# Altium schematic sheet MCED_schematic.SchDoc
size A; SheetNumber: 1; SheetTotal: 1
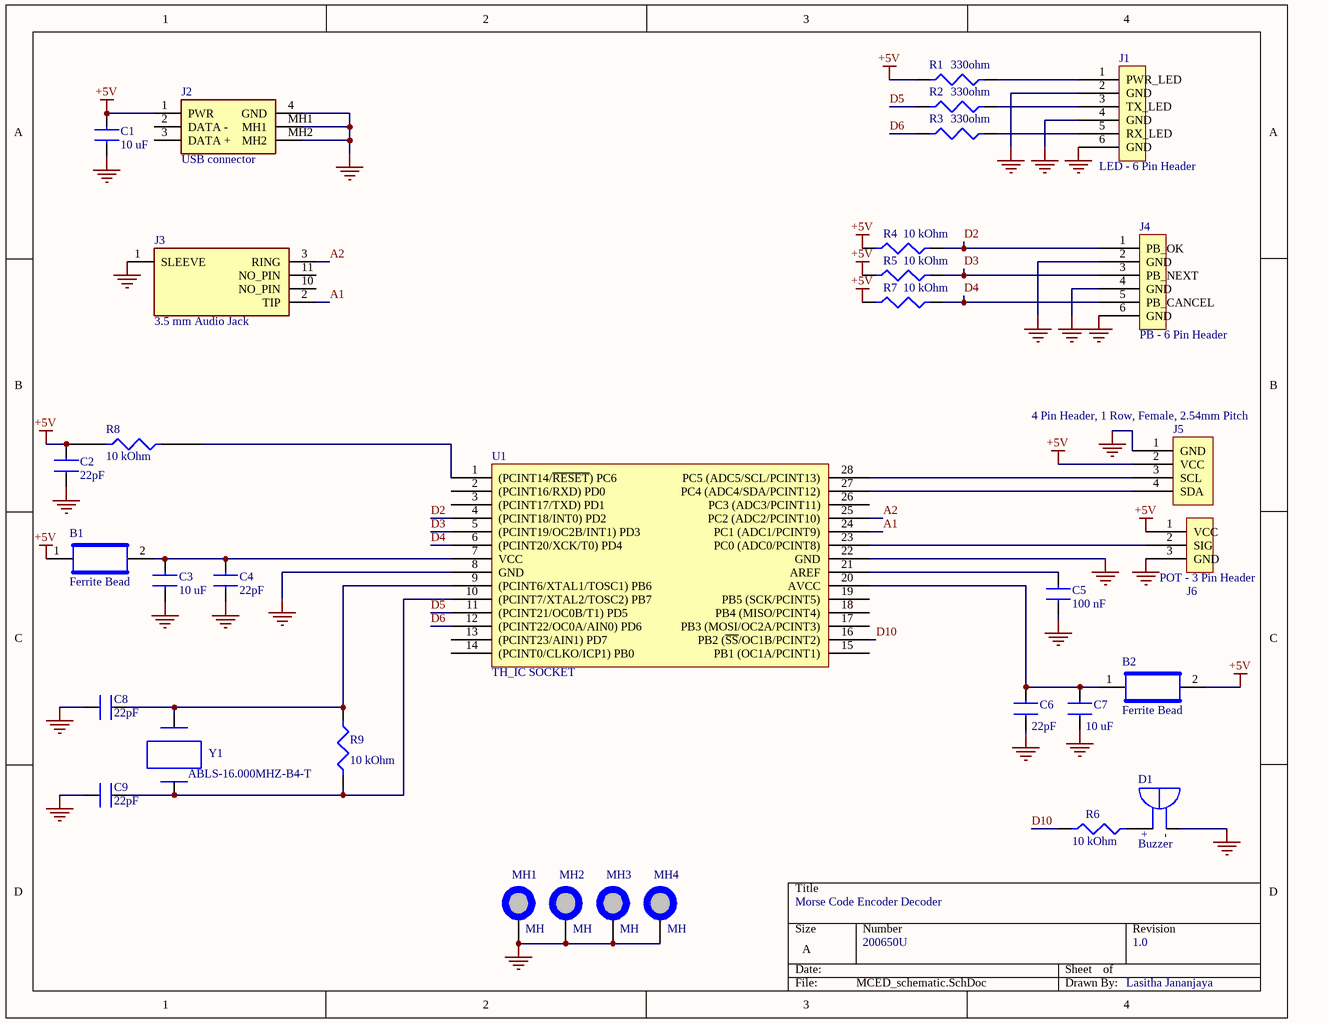
[diagram p0: MCED_schematic.SchDoc]

## Parts
B1  Ferrite Bead  [FERRITE BEAD C2012X105N]
B2  Ferrite Bead  [FERRITE BEAD C2012X105N]
C1  10 uF  [C0805]
C2  22pF  [C0805]
C3  10 uF  [C0805]
C4  22pF  [C0805]
C5  100 nF  [C0805]
C6  22pF  [C0805]
C7  10 uF  [C0805]
C8  22pF  [C0805]
C9  22pF  [C0805]
D1  Buzzer  [Buzzer]
J1  LED - 6 Pin Header  [6 PIN HEADER]
J2  USB connector  [USB 2.0 type B 617291011BLF]
J3  3.5 mm Audio Jack  [Audio Jack SJ13523N]
J4  PB - 6 Pin Header  [6 PIN HEADER]
J5  4 Pin Header, 1 Row, Female, 2.54mm Pitch  [4 Pin Header]
J6  POT - 3 Pin Header  [3 PIN HEADER]
MH1  MH  [Mounting Hole]  (no BOM)
MH2  MH  [Mounting Hole]  (no BOM)
MH3  MH  [Mounting Hole]  (no BOM)
MH4  MH  [Mounting Hole]  (no BOM)
R1  330ohm  [300Ohm RESC2012X60N]
R2  330ohm  [300Ohm RESC2012X60N]
R3  330ohm  [300Ohm RESC2012X60N]
R4  10 kOhm  [10K]
R5  10 kOhm  [10K]
R6  10 kOhm  [10K]
R7  10 kOhm  [10K]
R8  10 kOhm  [10K]
R9  10 kOhm  [10K]
U1  TH_IC SOCKET  [28dip_through_hole_ic_socket]
Y1  ABLS-16.000MHZ-B4-T  [ABLS-16.000MHZ-B4-T_CRYSTAL]

## Nets
+5V: B1.1 B2.2 C1.2 C2.2 J2.1(PWR) J5.2(VCC) J6.1(VCC) R1.1 R4.2 R5.2 R7.2 R8.2
GND: C1.1 C2.1 C3.1 C4.1 C5.1 C6.1 C7.1 C8.2 C9.2 D1.N(NEG) J1.2(GND) J1.4(GND) J1.6(GND) J2.4(GND) J2.MH1 J2.MH2 J3.1(SLEEVE) J4.2(GND) J4.4(GND) J4.6(GND) J5.1(GND) J6.3(GND) MH1.1 MH2.1 MH3.1 MH4.1 U1.8(GND) U1.22(GND)
A1: J3.2(TIP) U1.24(PC1_(ADC1/PCINT9))
A2: J3.3(RING) U1.25(PC2_(ADC2/PCINT10))
D2: J4.1(PB_OK) R4.1 U1.4((PCINT18/INT0)_PD2)
D3: J4.3(PB_NEXT) R5.1 U1.5((PCINT19/OC2B/INT1)_PD3)
D4: J4.5(PB_CANCEL) R7.1 U1.6((PCINT20/XCK/T0)_PD4)
D5: R2.1 U1.11((PCINT21/OC0B/T1)_PD5)
D6: R3.1 U1.12((PCINT22/OC0A/AIN0)_PD6)
D10: R6.2 U1.16(PB2_(~{SS}/OC1B/PCINT2))
NetB1_2: B1.2 C3.2 C4.2 U1.7(VCC)
NetB2_1: B2.1 C6.2 C7.2 U1.20(AVCC)
NetC5_2: C5.2 U1.21(AREF)
NetC8_1: C8.1 R9.2 U1.9((PCINT6/XTAL1/TOSC1)_PB6) Y1.2
NetC9_1: C9.1 R9.1 U1.10((PCINT7/XTAL2/TOSC2)_PB7) Y1.1
NetD1_P: D1.P(POS) R6.1
NetJ1_1: J1.1(PWR_LED) R1.2
NetJ1_3: J1.3(TX_LED) R2.2
NetJ1_5: J1.5(RX_LED) R3.2
NetJ5_3: J5.3(SCL) U1.28(PC5_(ADC5/SCL/PCINT13))
NetJ5_4: J5.4(SDA) U1.27(PC4_(ADC4/SDA/PCINT12))
NetJ6_2: J6.2(SIG) U1.23(PC0_(ADC0/PCINT8))
NetR8_1: R8.1 U1.1((PCINT14/~{RESET})_PC6)

Not connected (* = marked no-connect by the designer): J2 2(DATA_-) 3(DATA_+); J3 10(NO_PIN) 11(NO_PIN); U1 2((PCINT16/RXD)_PD0) 3((PCINT17/TXD)_PD1) 13((PCINT23/AIN1)_PD7) 14((PCINT0/CLKO/ICP1)_PB0) 15(PB1_(OC1A/PCINT1)) 17(PB3_(MOSI/OC2A/PCINT3)) 18(PB4_(MISO/PCINT4)) 19(PB5_(SCK/PCINT5)) 26(PC3_(ADC3/PCINT11))

## Notes on the sheet
- Morse Code Encoder Decoder
- 200650U
- 1.0
- Lasitha Jananjaya
- (in symbol KXG1201C) +; -

## Library data of the parts
B1 B2 = MPZ2012S601AT000: Ferrite Bead, 1 Function(s), 2A; Manufacturer: TDK; DC Resistance-Max: 100mR; Filter Type: FERRITE CHIP; Clock Frequency: 100MHz; Channels: 1; Output Impedance: 600R; Supplier: Mouser; Supplier Part Number: 810-MPZ2012S601AT000; Manufacturer Part Number: MPZ2012S601AT000; RoHS: Yes; Category: Ferrite Beads and Chips; Stock: 782263; Pricing: 1=0.12, 10=0.061, 50=0.061, 100=0.042, 1000=0.035, 10000=0.027 (USD); Mounting Technology: Surface Mount; Material: Ferrite; Case Code: 0805; Terminal Finish: Copper; Min Operating Temperature: -55°C; Max Operating Temperature: 125°C; JESD-609 Code: e2; Construction: Chip Bead; Min Frequency: 100MHz; Packaging: Tape and Reel; Current Rating: 2A; Length: 2mm; Width: 1.25mm; Height: 0.85mm; Reach SVHC Compliant: Yes; RoHS Compliant: Yes; ComponentLink1URL: https://datasheet.ciiva.com:443/pdfs/VipMasterIC/IC/TDKC/TDKC-S-A0008032886/TDKC-S-A0008032886-1.pdf?src-supplier=IHS+Markit; ComponentLink1Description: https://datasheet.ciiva.com:443/pdfs/VipMasterIC/IC/TDKC/TDKC-S-A0008032886/TDKC-S-A0008032886-1.pdf?src-supplier=IHS+Markit; ComponentLink2URL: https://datasheet.ciiva.com/46634/beads-commercial-power-mpz-en-46634335.pdf?src-supplier=Digi-Key; ComponentLink2Description: https://datasheet.ciiva.com/46634/beads-commercial-power-mpz-en-46634335.pdf?src-supplier=Digi-Key; ComponentLink3URL: https://datasheet.ciiva.com/46634/beads-commercial-power-mpz-en-46634377.pdf?src-supplier=Digi-Key; ComponentLink3Description: https://datasheet.ciiva.com/46634/beads-commercial-power-mpz-en-46634377.pdf?src-supplier=Digi-Key; ComponentLink4URL: https://datasheet.ciiva.com/46634/beads-commercial-power-mpz-en-46634606.pdf?src-supplier=Digi-Key; ComponentLink4Description: https://datasheet.ciiva.com/46634/beads-commercial-power-mpz-en-46634606.pdf?src-supplier=Digi-Key
C1 C3 C5 C7 = CL21A106KBYQNNE: 10 uF Ceramic Capacitor, Multilayer, Ceramic, 50V, 10% +Tol, 10% -Tol, X5R, 15% TC, 10uF, Surface Mount, 0805; Manufacturer: Samsung; Supplier: Mouser; Supplier Part Number: 187-CL21A106KBYQNNE; Manufacturer Part Number: CL21A106KBYQNNE; RoHS: Yes; Category: Ceramic Capacitors; Stock: 29602; Pricing: 1=0.42, 10=0.299, 50=0.299, 100=0.197, 1000=0.124, 10000=0.1 (USD); Pins: 2; Dielectric Material: Ceramic; Capacitor Type: Ceramic; Reach SVHC Compliant: Yes; RoHS Compliant: Yes; ComponentLink1URL: https://datasheet.ciiva.com:443/pdfs/VipMasterIC/IC/SEMS/SEMS-S-A0008524728/SEMS-S-A0008519922-1.pdf?src-supplier=IHS+Markit; ComponentLink1Description: https://datasheet.ciiva.com:443/pdfs/VipMasterIC/IC/SEMS/SEMS-S-A0008524728/SEMS-S-A0008519922-1.pdf?src-supplier=IHS+Markit
C2 C4 C6 C8 C9 = VJ0805A220GXACW1BC: 22pF Ceramic Capacitor, Multilayer, Ceramic, 50V, 2% +Tol, 2% -Tol, C0G, -/+30ppm/Cel TC, 0.000022uF, Surface Mount, 0805; Manufacturer: Vishay Vitramon; Manufacturer Series: VJ; Multilayer: Yes; Supplier: LCSC; Supplier Part Number: C2174318; Manufacturer Part Number: VJ0805A220GXACW1BC; RoHS: Yes; Category: Ceramic Capacitors; Stock: 3750; Pricing: 5=0.0755, 50=0.0623, 150=0.0557, 500=0.0508, 2500=0.042, 4000=0.04 (USD); Mounting Technology: Surface Mount; Pins: 2; Dielectric Material: Ceramic; Package Shape: Rectangular; Case/Package: 0805; Terminal Finish: Tin; Min Operating Temperature: -55°C; Max Operating Temperature: 125°C; JESD-609 Code: e3; Value: 22pF; Capacitor Type: Ceramic; Tolerance  (fill in as +-): 2%; Packaging: Tape and Reel; Tolerance (fill in as +-): 2%; Rated DC Voltage (URdc): 50V; Temperature Characteristics Code: C0G; Termination: Wraparound; Reach SVHC Compliant: Yes; RoHS Compliant: Yes; ComponentLink1URL: https://datasheet.ciiva.com:443/pdfs/VipMasterIC/IC/BEYS/BEYSS01615/BEYSS01615-1.pdf?src-supplier=IHS+Markit; ComponentLink1Description: https://datasheet.ciiva.com:443/pdfs/VipMasterIC/IC/BEYS/BEYSS01615/BEYSS01615-1.pdf?src-supplier=IHS+Markit; ComponentLink2URL: https://datasheet.ciiva.com/16511/vjw1bcbascomseries-16511287.pdf?src-supplier=Future+Electronics; ComponentLink2Description: https://datasheet.ciiva.com/16511/vjw1bcbascomseries-16511287.pdf?src-supplier=Future+Electronics
D1 = KXG1201C: Buzzer - Magnetic Indicator Active Buzzer [Kingstate], Pine Type, Dimensions(mm): 12.00*9.50, Voltage:1.2~3.0, Max current consumption(mA): Max. 30, SPL(dB): Min. 80dB(Typical 85)@10cm, Frequency(KHz): 2.30.; Package: None; MF: Kingstate; Value: *; Availability: In Stock; SnapEDA_Link: https://www.snapeda.com/parts/KXG1201C/Kingstate/view-part/?ref=snap; MP: KXG1201C; Price: None; Check_prices: https://www.snapeda.com/parts/KXG1201C/Kingstate/view-part/?ref=eda
J1 J4 = 929850-01-06-RB: 6 Pin Header Board Connector; Manufacturer: 3M; Manufacturer Series: 929; Supplier: Mouser; Supplier Part Number: 517-929850-01-06-RB; Manufacturer Part Number: 929850-01-06-RB; RoHS: Yes; Category: Headers and Wire Housings; Stock: 258; Pricing: 1=2.56, 10=2.08, 50=2.08, 100=1.99, 1000=1.42, 10000=1.26 (USD); Connector Type: BOARD CONNECTOR; Reach SVHC Compliant: Yes; RoHS Compliant: Yes; ComponentLink1URL: https://datasheet.ciiva.com:443/pdfs/VipMasterIC/IC/IIIM/IIIMS03618/IIIMS03618-1.pdf?src-supplier=IHS+Markit; ComponentLink1Description: https://datasheet.ciiva.com:443/pdfs/VipMasterIC/IC/IIIM/IIIMS03618/IIIMS03618-1.pdf?src-supplier=IHS+Markit; ComponentLink2URL: https://datasheet.ciiva.com/5148/ts0815-5148223.pdf?src-supplier=Mouser; ComponentLink2Description: https://datasheet.ciiva.com/5148/ts0815-5148223.pdf?src-supplier=Mouser; ComponentLink3URL: https://datasheet.ciiva.com/756/ts0815-756418.pdf?src-supplier=Digi-Key; ComponentLink3Description: https://datasheet.ciiva.com/756/ts0815-756418.pdf?src-supplier=Digi-Key
J2 = 61729-1011BLF: USB 2.0 connector, Type B, Receptacle, Through Hole, 30u GXT Contact, 4 Pins, 1.57mm PCB; Manufacturer: Amphenol ICC / FCI; Supplier: Avnet; Supplier Part Number: 61729-1011BLF; Manufacturer Part Number: 61729-1011BLF; RoHS: No; Category: Connectors; ComponentLink1URL: https://datasheet.ciiva.com/8015/697864-8015261.pdf?src-supplier=Element14; ComponentLink1Description: https://datasheet.ciiva.com/8015/697864-8015261.pdf?src-supplier=Element14
J3 = SJ1-3523N: 3.5 mm Audio Jack, Female, 3 Pole(s), Solder Terminal, Jack; Manufacturer: CUI Devices; Supplier: Mouser; Supplier Part Number: 490-SJ1-3523N; Manufacturer Part Number: SJ1-3523N; RoHS: Yes; Category: Audio / Video Connectors; Stock: 9497; Pricing: 1=1.08, 10=0.913, 50=0.913, 100=0.819, 1000=0.596, 10000=0.495 (USD); Reach SVHC Compliant: Yes
J5 = M20-7820446: 4 Pin Header Board Connector, 4 Contact(s), 1 Row(s), Female, Straight, 0.1 inch Pitch, Solder Terminal, Locking, Black Insulator, Socket; Manufacturer: Harwin; Option: General Purpose; Contact Pattern: RECTANGULAR; Contact Resistance: 20mR; Contact Style: SQ PIN-SKT; Dielectric Withstanding Voltage (AC): 1kV; Durability: 300Cycles; Filter Feature: No; Insulation Resistance: 1GR; Number Of Connectors: 1; Polarization Key: POLARIZED HOUSING; Rated Current (Signal): 3A; Number of Contacts: 4; Body Breadth: 0.098inch; Body Depth: 0.335inch; Body Length: 0.4inch; Reference Standard: UL; Reliability: COMMERCIAL; Supplier: Digi-Key; Supplier Part Number: 952-1792-ND; Manufacturer Part Number: M20-7820446; RoHS: Yes; Category: Headers and Wire Housings; Stock: 3461; Pricing: 1=1.02, 10=0.859, 100=0.771, 500=0.63084, 1000=0.56075, 5000=0.49066, 10000=0.46613 (USD); Mounting Technology: Board; Contact Finish - Mating: TIN; Contact Finish - Termination: TIN; Insulation Color: Black; Insulation Material: Polyamide; Min Operating Temperature: -40°C; Max Operating Temperature: 105°C; Connector Type: BOARD CONNECTOR; JESD-609 Code: e3; Body/Shell Style: SOCKET; Contact Gender: Female; Mixed Contacts: No; Mounting Style: STRAIGHT; Number Of PCB Rows: 1; Number of Rows Loaded: 1; PCB Contact Pattern: RECTANGULAR; Termination: Solder; Mating Contact Pitch: 0.1inch; Mounting Option 1: LOCKING; Terminal Length: 0.118inch; Terminal Pitch: 2.54mm; Flammability Rating: UL94 V-0; DIN Conformance: No; IEC Conformance: No; MIL Conformance: No; Reach SVHC Compliant: Yes; RoHS Compliant: Yes; ComponentLink1URL: https://datasheet.ciiva.com:443/pdfs/VipMasterIC/IC/HRWN/HRWN-S-A0004894635/HRWN-S-A0004894635-1.pdf?src-supplier=IHS+Markit; ComponentLink1Description: https://datasheet.ciiva.com:443/pdfs/VipMasterIC/IC/HRWN/HRWN-S-A0004894635/HRWN-S-A0004894635-1.pdf?src-supplier=IHS+Markit; ComponentLink2URL: https://datasheet.ciiva.com/11747/0900766b80dc1d2b-11747084.pdf?src-supplier=Rs; ComponentLink2Description: https://datasheet.ciiva.com/11747/0900766b80dc1d2b-11747084.pdf?src-supplier=Rs; ComponentLink3URL: https://datasheet.ciiva.com/6784/m20-782-6784360.pdf?src-supplier=Digi-Key; ComponentLink3Description: https://datasheet.ciiva.com/6784/m20-782-6784360.pdf?src-supplier=Digi-Key; ComponentLink4URL: https://datasheet.ciiva.com/7639/1836950-7639727.pdf?src-supplier=Element14; ComponentLink4Description: https://datasheet.ciiva.com/7639/1836950-7639727.pdf?src-supplier=Element14; ComponentLink5URL: https://datasheet.ciiva.com/10151/m20-782-10151359.pdf?src-supplier=Avnet; ComponentLink5Description: https://datasheet.ciiva.com/10151/m20-782-10151359.pdf?src-supplier=Avnet
J6 = 929850-01-03-RA: 3 Pin Header Board Connector, 3 Contact(s), 1 Row(s), Female, Straight, Solder Terminal, Socket; Manufacturer: 3M; Manufacturer Series: 929; Option: General Purpose; Filter Feature: No; Number of Rows Loaded: 1; Number of Contacts: 3; Supplier: Digi-Key; Supplier Part Number: 19-929850-01-03-RA-ND; Manufacturer Part Number: 929850-01-03-RA; RoHS: Yes; Category: Headers and Wire Housings; Stock: 1296; Pricing: 1=1.97, 10=1.719, 100=1.536, 500=1.28002, 1000=1.09716, 5000=0.97282, 10000=0.95088 (USD); Mounting Technology: Board; Contact Material: Copper Alloy; Contact Finish - Mating: GOLD (10) OVER NICKEL (100); Contact Finish - Termination: MATTE TIN OVER NICKEL (100); Connector Type: BOARD CONNECTOR; JESD-609 Code: e3; Additional Feature: 3M; Body/Shell Style: SOCKET; Contact Gender: Female; Mixed Contacts: No; Mounting Style: STRAIGHT; Termination: Solder; Terminal Pitch: 2.54mm; Flammability Rating: UL94 V-0; DIN Conformance: No; IEC Conformance: No; MIL Conformance: No; Reach SVHC Compliant: Yes; RoHS Compliant: Yes; ComponentLink1URL: https://datasheet.ciiva.com:443/pdfs/VipMasterIC/IC/IIIM/IIIMS03618/IIIMS03618-1.pdf?src-supplier=IHS+Markit; ComponentLink1Description: https://datasheet.ciiva.com:443/pdfs/VipMasterIC/IC/IIIM/IIIMS03618/IIIMS03618-1.pdf?src-supplier=IHS+Markit; ComponentLink2URL: https://datasheet.ciiva.com/746/ts0815-746343.pdf?src-supplier=Digi-Key; ComponentLink2Description: https://datasheet.ciiva.com/746/ts0815-746343.pdf?src-supplier=Digi-Key; ComponentLink3URL: https://datasheet.ciiva.com/5167/ts0815-5167287.pdf?src-supplier=Mouser; ComponentLink3Description: https://datasheet.ciiva.com/5167/ts0815-5167287.pdf?src-supplier=Mouser
MH1-MH4 = Mounting Hole
R1-R3 = CRCW0805330RFKEA: 330ohm, Fixed Resistor, Metal Glaze/thick Film, 0.125W, 150V, 1% +/-Tol, 100ppm/Cel, Surface Mount, 0805; Manufacturer: Vishay; Power: 125mW; Value: 330R; Temperature Coefficient: 100ppm/°C; Rated Temperature: 70°C; Package Height: 0.45mm; Package Length: 2mm; Package Width: 1.25mm; Reference Standard: AEC-Q200; Supplier: Mouser; Supplier Part Number: 71-CRCW0805-330-E3; Manufacturer Part Number: CRCW0805330RFKEA; RoHS: Yes; Category: Chip SMD Resistors; Stock: 46; Pricing: 1=0.13, 10=0.068, 50=0.068, 100=0.028, 1000=0.013, 10000=0.008 (USD); Mounting Technology: Surface Mount; Pins: 2; Case/Package: 0805; Terminal Finish: Nickel; Package Shape: Rectangular; Min Operating Temperature: -55°C; Max Operating Temperature: 155°C; Tolerance: 1%; JESD-609 Code: e3; Resistor Type: FIXED RESISTOR; Construction: Chip; Package Style: SMTMeter; Packaging: Tape and Reel; Technology: METAL GLAZE/THICK FILM; Working Voltage: 150V; Termination: Wraparound; Reach SVHC Compliant: Yes; RoHS Compliant: Yes; ComponentLink1URL: https://datasheet.ciiva.com:443/pdfs/VipMasterIC/IC/VISH/VISH-S-A0007266705/VISH-S-A0007266705-1.pdf?src-supplier=IHS+Markit; ComponentLink1Description: https://datasheet.ciiva.com:443/pdfs/VipMasterIC/IC/VISH/VISH-S-A0007266705/VISH-S-A0007266705-1.pdf?src-supplier=IHS+Markit; ComponentLink2URL: https://datasheet.ciiva.com/7777/1720486-7777573.pdf?src-supplier=Element14; ComponentLink2Description: https://datasheet.ciiva.com/7777/1720486-7777573.pdf?src-supplier=Element14; ComponentLink3URL: https://datasheet.ciiva.com/8944/dcrcwe3-8944773.pdf?src-supplier=Avnet; ComponentLink3Description: https://datasheet.ciiva.com/8944/dcrcwe3-8944773.pdf?src-supplier=Avnet; ComponentLink4URL: https://datasheet.ciiva.com/8944/dcrcwe3-8944776.pdf?src-supplier=Avnet; ComponentLink4Description: https://datasheet.ciiva.com/8944/dcrcwe3-8944776.pdf?src-supplier=Avnet; ComponentLink5URL: https://datasheet.ciiva.com/2495/dcrcwe3-2495804.pdf?src-supplier=Digi-Key; ComponentLink5Description: https://datasheet.ciiva.com/2495/dcrcwe3-2495804.pdf?src-supplier=Digi-Key; ComponentLink6URL: https://datasheet.ciiva.com/5545/dcrcwe3-109170-5545357.pdf?src-supplier=Mouser; ComponentLink6Description: https://datasheet.ciiva.com/5545/dcrcwe3-109170-5545357.pdf?src-supplier=Mouser; ComponentLink7URL: https://datasheet.ciiva.com/7777/1697337-7777390.pdf?src-supplier=Element14; ComponentLink7Description: https://datasheet.ciiva.com/7777/1697337-7777390.pdf?src-supplier=Element14; ComponentLink8URL: https://datasheet.ciiva.com/2495/dcrcwe3-2495805.pdf?src-supplier=Digi-Key; ComponentLink8Description: https://datasheet.ciiva.com/2495/dcrcwe3-2495805.pdf?src-supplier=Digi-Key; ComponentLink9URL: https://datasheet.ciiva.com/2495/dcrcwe3-2495803.pdf?src-supplier=Digi-Key; ComponentLink9Description: https://datasheet.ciiva.com/2495/dcrcwe3-2495803.pdf?src-supplier=Digi-Key; ComponentLink10URL: https://datasheet.ciiva.com/16769/70201119-16769852.pdf?src-supplier=Allied+Electronics; ComponentLink10Description: https://datasheet.ciiva.com/16769/70201119-16769852.pdf?src-supplier=Allied+Electronics
R4-R9 = MCU0805MD1002DP500: 10 kOhm, Fixed Resistor, Thin Film, 0.2W, 10000ohm, 150V, 0.5% +/-Tol, -25,25ppm/Cel, 0805; Manufacturer: Vishay Beyschlag; Power: 200mW; Value: 10kR; Temperature Coefficient: -2525ppm/°C; Package Height: 0.52mm; Package Length: 2mm; Package Width: 1.25mm; Reference Standard: AEC-Q200; Supplier: Mouser; Supplier Part Number: 594-MCU0805MD1002DP5; Manufacturer Part Number: MCU0805MD1002DP500; RoHS: Yes; Category: Chip SMD Resistors; Stock: 49020; Pricing: 1=0.39, 10=0.3, 50=0.3, 100=0.127, 1000=0.07, 10000=0.06 (USD); Pins: 2; Case/Package: 0805; Terminal Finish: Nickel; Min Operating Temperature: -55°C; Max Operating Temperature: 175°C; Tolerance: 0.5%; JESD-609 Code: e3; Resistor Type: FIXED RESISTOR; Construction: Chip; Package Style: SMTMeter; Packaging: Tape and Reel; Series: MCU 0805 AT-PROF; Technology: THIN FILM; Working Voltage: 150V; Reach SVHC Compliant: Yes; RoHS Compliant: Yes; ComponentLink1URL: https://datasheet.ciiva.com:443/pdfs/VipMasterIC/IC/VISH/VISH-S-A0002932058/VISH-S-A0002932058-1.pdf?src-supplier=IHS+Markit; ComponentLink1Description: https://datasheet.ciiva.com:443/pdfs/VipMasterIC/IC/VISH/VISH-S-A0002932058/VISH-S-A0002932058-1.pdf?src-supplier=IHS+Markit; ComponentLink2URL: https://datasheet.ciiva.com/12696/mcat-pro-223602-12696124.pdf?src-supplier=Mouser; ComponentLink2Description: https://datasheet.ciiva.com/12696/mcat-pro-223602-12696124.pdf?src-supplier=Mouser
U1 = ICS-328-T: Through Hole IC Sockets 28P / .300"; Manufacturer: Adam Equipment; Supplier: Arrow Electronics; Supplier Part Number: ICS-328-T; Manufacturer Part Number: ICS-328-T; RoHS: Yes; Category: IC and Component Sockets; Stock: 603; Pricing: 1=0.1941, 17=0.1922, 34=0.1565, 51=0.1549, 85=0.1534, 238=0.139, 442=0.1333, 952=0.1182 (USD); ComponentLink1URL: https://datasheet.ciiva.com/16210/page-187-188-16210500.pdf?src-supplier=Future+Electronics; ComponentLink1Description: https://datasheet.ciiva.com/16210/page-187-188-16210500.pdf?src-supplier=Future+Electronics
Y1 = ABLS-16.000MHZ-B4-T: 16MHz ±30ppm 晶体 18pF 40 欧姆 -20°C ~ 70°C  表面贴装 HC49/US; Manufacturer: Abracon; Supplier: LCSC; Supplier Part Number: C596821; Manufacturer Part Number: ABLS-16.000MHZ-B4-T; RoHS: Yes; Category: Crystals; Stock: 196; Pricing: 1=0.2737, 10=0.1984, 30=0.1552, 100=0.136, 500=0.1275, 1000=0.1224 (USD); ComponentLink1URL: https://datasheet.ciiva.com/15116/getdatasheetpartid-719935-15116811.pdf?src-supplier=Verical; ComponentLink1Description: https://datasheet.ciiva.com/15116/getdatasheetpartid-719935-15116811.pdf?src-supplier=Verical; ComponentLink2URL: https://datasheet.ciiva.com/854/abls-854145.pdf?src-supplier=Digi-Key; ComponentLink2Description: https://datasheet.ciiva.com/854/abls-854145.pdf?src-supplier=Digi-Key; ComponentLink3URL: https://datasheet.ciiva.com/854/abls-854144.pdf?src-supplier=Digi-Key; ComponentLink3Description: https://datasheet.ciiva.com/854/abls-854144.pdf?src-supplier=Digi-Key; ComponentLink4URL: https://datasheet.ciiva.com/854/abls-854146.pdf?src-supplier=Digi-Key; ComponentLink4Description: https://datasheet.ciiva.com/854/abls-854146.pdf?src-supplier=Digi-Key; ComponentLink5URL: https://datasheet.ciiva.com/3175/abls-3175359.pdf?src-supplier=Avnet; ComponentLink5Description: https://datasheet.ciiva.com/3175/abls-3175359.pdf?src-supplier=Avnet; ComponentLink6URL: https://datasheet.ciiva.com/16423/abls-16423759.pdf?src-supplier=Future+Electronics; ComponentLink6Description: https://datasheet.ciiva.com/16423/abls-16423759.pdf?src-supplier=Future+Electronics